# EAGLE design FRA_bulkhead_v2 (EAGLE 9.6.2)
CNAME: FRA universal bulkhead; CREVISION: 03
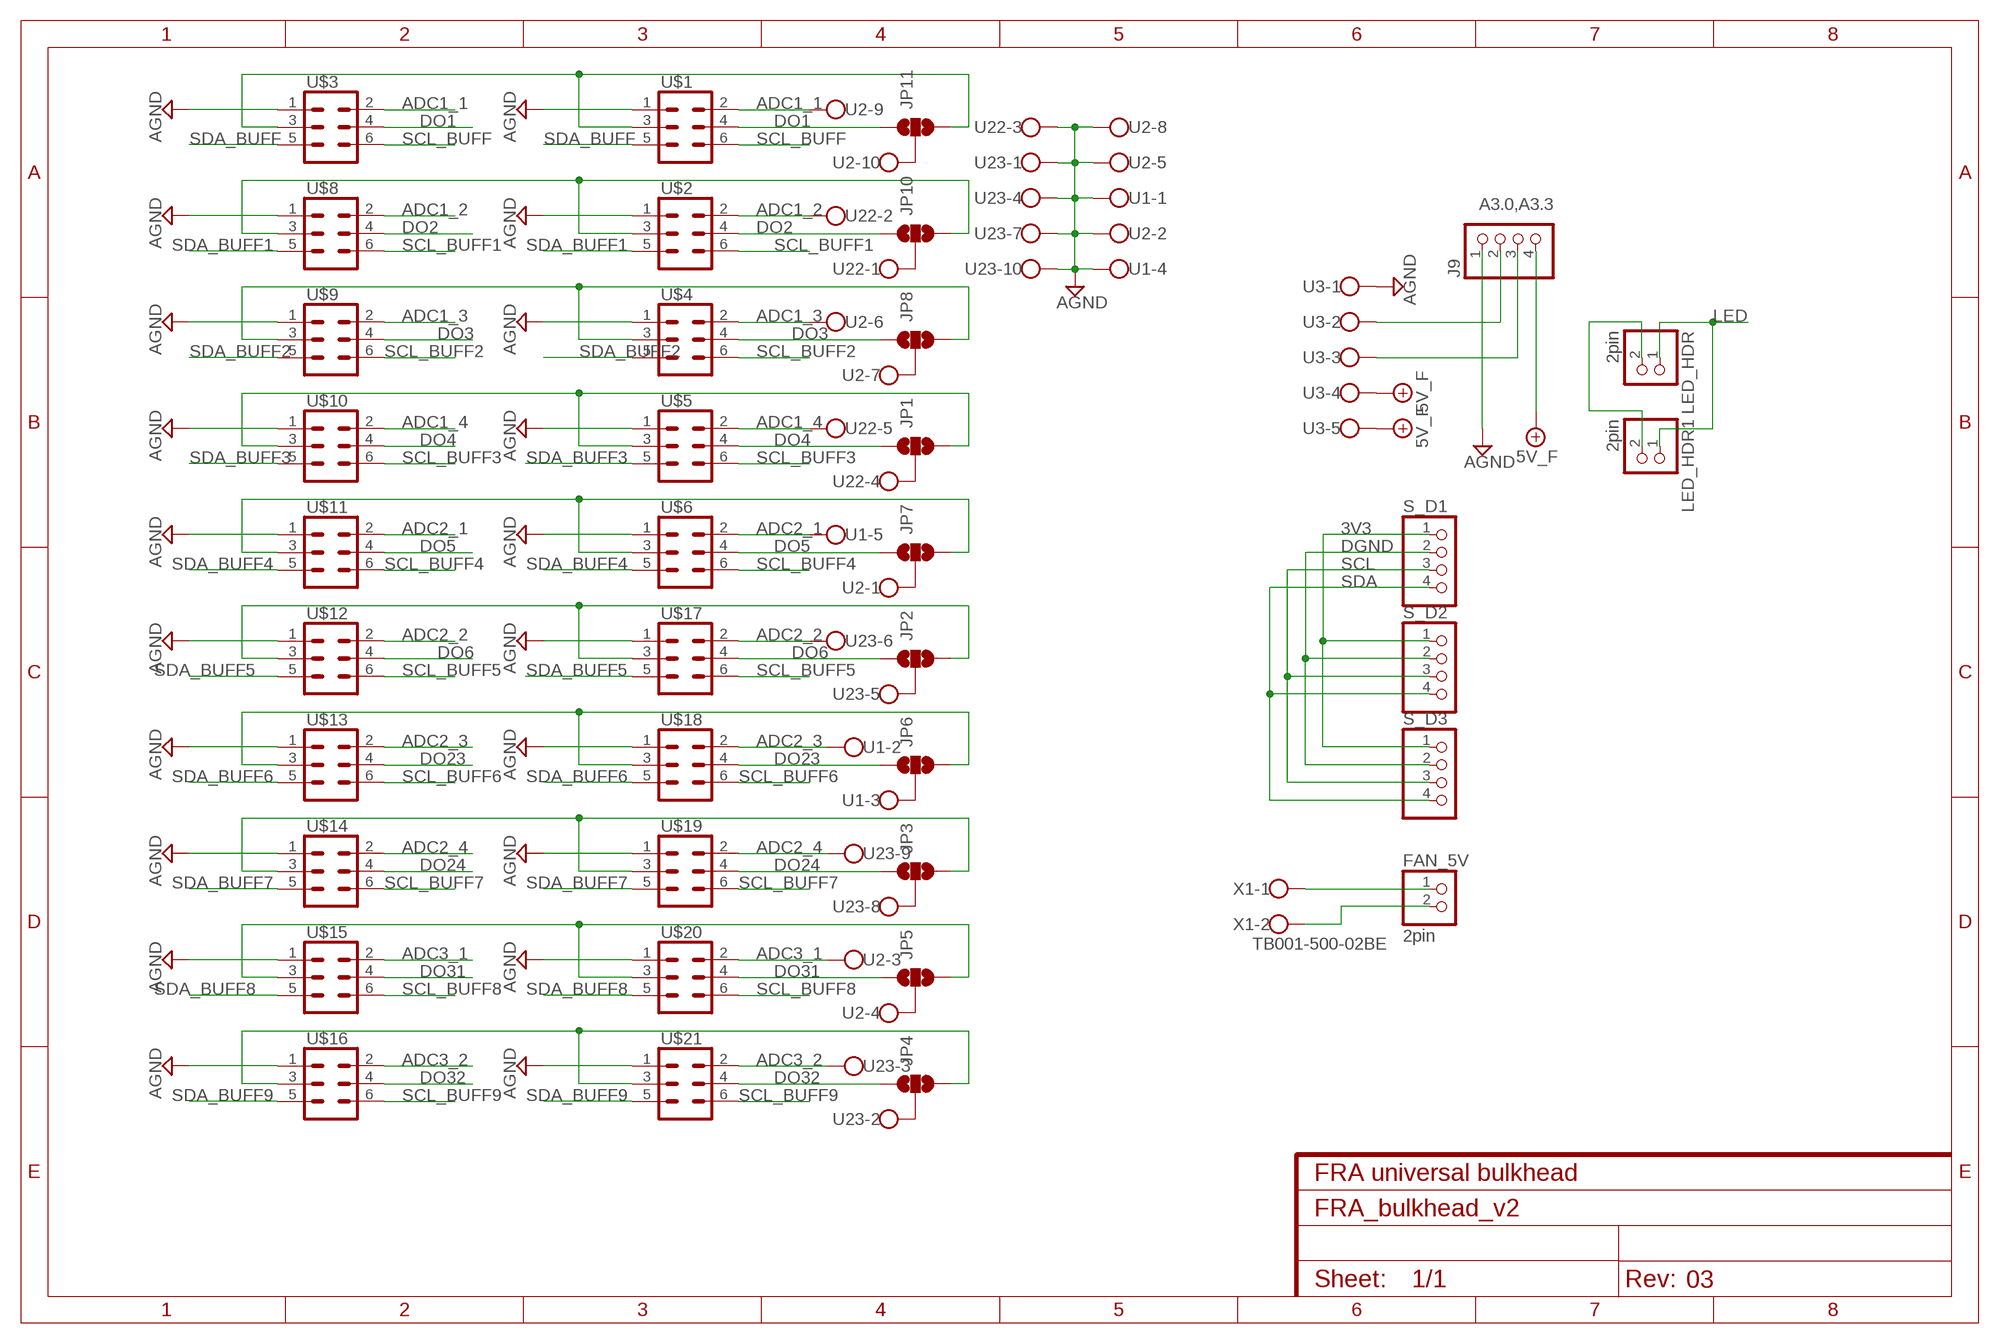
[diagram p0: schematic, sheet 1]

## Parts
FAN_5V  2pin  PINHD-1X2  [1X02]
J9  4pin  PINHD-1X4  [1X04]
JP1  JUMPER-SMT_3_NO_NO_SILK  [SMT-JUMPER_3_0-NO_TRACE_NO-SILK]
JP2  JUMPER-SMT_3_NO_NO_SILK  [SMT-JUMPER_3_0-NO_TRACE_NO-SILK]
JP3  JUMPER-SMT_3_NO_NO_SILK  [SMT-JUMPER_3_0-NO_TRACE_NO-SILK]
JP4  JUMPER-SMT_3_NO_NO_SILK  [SMT-JUMPER_3_0-NO_TRACE_NO-SILK]
JP5  JUMPER-SMT_3_NO_NO_SILK  [SMT-JUMPER_3_0-NO_TRACE_NO-SILK]
JP6  JUMPER-SMT_3_NO_NO_SILK  [SMT-JUMPER_3_0-NO_TRACE_NO-SILK]
JP7  JUMPER-SMT_3_NO_NO_SILK  [SMT-JUMPER_3_0-NO_TRACE_NO-SILK]
JP8  JUMPER-SMT_3_NO_NO_SILK  [SMT-JUMPER_3_0-NO_TRACE_NO-SILK]
JP10  JUMPER-SMT_3_NO_NO_SILK  [SMT-JUMPER_3_0-NO_TRACE_NO-SILK]
JP11  JUMPER-SMT_3_NO_NO_SILK  [SMT-JUMPER_3_0-NO_TRACE_NO-SILK]
LED_HDR  2pin  PINHD-1X2  [1X02]
LED_HDR1  2pin  PINHD-1X2  [1X02]
S_D1  4pin  PINHD-1X4  [1X04]
S_D2  4pin  PINHD-1X4  [1X04]
S_D3  4pin  PINHD-1X4  [1X04]
U1  TB003V-500-P05BERIGHTANGLE-NORMAL  [TB003-500-P05BE]
U2  TB003V-500-P10BERIGHTANGLE-NORMAL  [TB003-500-P10BE]
U3  TB003V-500-P05BERIGHTANGLE-NORMAL  [TB003-500-P05BE]
U22  TB003V-500-P05BERIGHTANGLE-NORMAL  [TB003-500-P05BE]
U23  TB003V-500-P10BERIGHTANGLE-NORMAL  [TB003-500-P10BE]
U$1  CONN_03X2_WE_61200621621  [WE_61200621621]
U$2  CONN_03X2_WE_61200621621  [WE_61200621621]
U$3  CONN_03X2_WE_61200621621  [WE_61200621621]
U$4  CONN_03X2_WE_61200621621  [WE_61200621621]
U$5  CONN_03X2_WE_61200621621  [WE_61200621621]
U$6  CONN_03X2_WE_61200621621  [WE_61200621621]
U$8  CONN_03X2_WE_61200621621  [WE_61200621621]
U$9  CONN_03X2_WE_61200621621  [WE_61200621621]
U$10  CONN_03X2_WE_61200621621  [WE_61200621621]
U$11  CONN_03X2_WE_61200621621  [WE_61200621621]
U$12  CONN_03X2_WE_61200621621  [WE_61200621621]
U$13  CONN_03X2_WE_61200621621  [WE_61200621621]
U$14  CONN_03X2_WE_61200621621  [WE_61200621621]
U$15  CONN_03X2_WE_61200621621  [WE_61200621621]
U$16  CONN_03X2_WE_61200621621  [WE_61200621621]
U$17  CONN_03X2_WE_61200621621  [WE_61200621621]
U$18  CONN_03X2_WE_61200621621  [WE_61200621621]
U$19  CONN_03X2_WE_61200621621  [WE_61200621621]
U$20  CONN_03X2_WE_61200621621  [WE_61200621621]
U$21  CONN_03X2_WE_61200621621  [WE_61200621621]
X1  TB001-500-02BE  W237-102  [W237-102]

## Nets
3V3: S_D1.1 S_D2.1 S_D3.1
+5V/1: J9.4 U3.4 U3.5 ; supply symbol labelled 5V_F
ADC1_1: U2.9 U$1.2 U$3.2
ADC1_2: U22.2 U$2.2 U$8.2
ADC1_3: U2.6 U$4.2 U$9.2
ADC1_4: U22.5 U$5.2 U$10.2
ADC2_1: U1.5 U$6.2 U$11.2
ADC2_2: U23.6 U$12.2 U$17.2
ADC2_3: U1.2 U$13.2 U$18.2
ADC2_4: U23.9 U$14.2 U$19.2
ADC3_1: U2.3 U$15.2 U$20.2
ADC3_2: U23.3 U$16.2 U$21.2
AGND: J9.1 U1.1 U1.4 U2.2 U2.5 U2.8 U3.1 U22.3 U23.1 U23.4 U23.7 U23.10 U$1.1 U$2.1 U$3.1 U$4.1 U$5.1 U$6.1 U$8.1 U$9.1 U$10.1 U$11.1 U$12.1 U$13.1 U$14.1 U$15.1 U$16.1 U$17.1 U$18.1 U$19.1 U$20.1 U$21.1
DGND: S_D1.2 S_D2.2 S_D3.2
DO1: JP11.1 U$1.4 U$3.4
DO2: JP10.1 U$2.4 U$8.4
DO3: JP8.1 U$4.4 U$9.4
DO4: JP1.1 U$5.4 U$10.4
DO5: JP7.1 U$6.4 U$11.4
DO6: JP2.1 U$12.4 U$17.4
DO23: JP6.1 U$13.4 U$18.4
DO24: JP3.1 U$14.4 U$19.4
DO31: JP5.1 U$15.4 U$20.4
DO32: JP4.1 U$16.4 U$21.4
LED: LED_HDR1.1 LED_HDR.1
N$1: FAN_5V.1 X1.1
N$2: FAN_5V.2 X1.2
N$3: JP1.2 U22.4
N$4: JP2.2 U23.5
N$5: JP3.2 U23.8
N$6: JP4.2 U23.2
N$7: JP10.2 U22.1
N$8: JP11.2 U2.10
N$9: JP8.2 U2.7
N$10: JP5.2 U2.4
N$11: JP7.2 U2.1
N$12: JP6.2 U1.3
N$13: JP11.3 U$1.3 U$3.3
N$14: J9.3 U3.3
N$15: JP10.3 U$2.3 U$8.3
N$16: J9.2 U3.2
N$17: JP8.3 U$4.3 U$9.3
N$18: JP1.3 U$5.3 U$10.3
N$19: JP7.3 U$6.3 U$11.3
N$20: JP2.3 U$12.3 U$17.3
N$21: JP6.3 U$13.3 U$18.3
N$22: JP3.3 U$14.3 U$19.3
N$23: JP5.3 U$15.3 U$20.3
N$24: JP4.3 U$16.3 U$21.3
N$26: LED_HDR1.2 LED_HDR.2
SCL: S_D1.3 S_D2.3 S_D3.3
SCL_BUFF: U$1.6 U$3.6
SCL_BUFF1: U$2.6 U$8.6
SCL_BUFF2: U$4.6 U$9.6
SCL_BUFF3: U$5.6 U$10.6
SCL_BUFF4: U$6.6 U$11.6
SCL_BUFF5: U$12.6 U$17.6
SCL_BUFF6: U$13.6 U$18.6
SCL_BUFF7: U$14.6 U$19.6
SCL_BUFF8: U$15.6 U$20.6
SCL_BUFF9: U$16.6 U$21.6
SDA: S_D1.4 S_D2.4 S_D3.4
SDA_BUFF: U$1.5 U$3.5
SDA_BUFF1: U$2.5 U$8.5
SDA_BUFF2: U$4.5 U$9.5
SDA_BUFF3: U$5.5 U$10.5
SDA_BUFF4: U$6.5 U$11.5
SDA_BUFF5: U$12.5 U$17.5
SDA_BUFF6: U$13.5 U$18.5
SDA_BUFF7: U$14.5 U$19.5
SDA_BUFF8: U$15.5 U$20.5
SDA_BUFF9: U$16.5 U$21.5

## Notes on the sheet
- A3.0,A3.3

## Library data of the parts
FAN_5V LED_HDR LED_HDR1 = pinhead:PINHD-1X2: PIN HEADER; PARTNO: TSW-102-07-G-S
J9 S_D1-S_D3 = pinhead:PINHD-1X4: PIN HEADER; PARTNO: 61300411121
JP1-JP8 JP10 JP11 = SparkFun-Jumpers:JUMPER-SMT_3_NO: Normally open jumper This jumper has three pads in close proximity to each other. Apply solder to close the connection(s).
U1 U3 U22 = SamacSys_Parts:TB003V-500-P05BE
U2 U23 = SamacSys_Parts:TB003V-500-P10BE
U$1-U$6 U$8-U$21 = FRA_eagle_lib:CONN_03X2_WE_61200621621: https://eu.mouser.com/ProductDetail/Wurth-Elektronik/61200621621?qs=sGAEpiMZZMs%252BGHln7q6pm%2FFhW%252BtWvhAgbNxkR%252BlwXp8Ip%2FAN9J9VOg%3D%3D https://eu.mouser.com/datasheet/2/445/6120xx21621-265830.pdf; PARTNO: 61200621621
X1 = con-wago-500:W237-102: WAGO SCREW CLAMP; MPN: 237-102; OC_FARNELL: unknown; OC_NEWARK: 70K9898; PARTNO: TB001-500-02BE

## Board
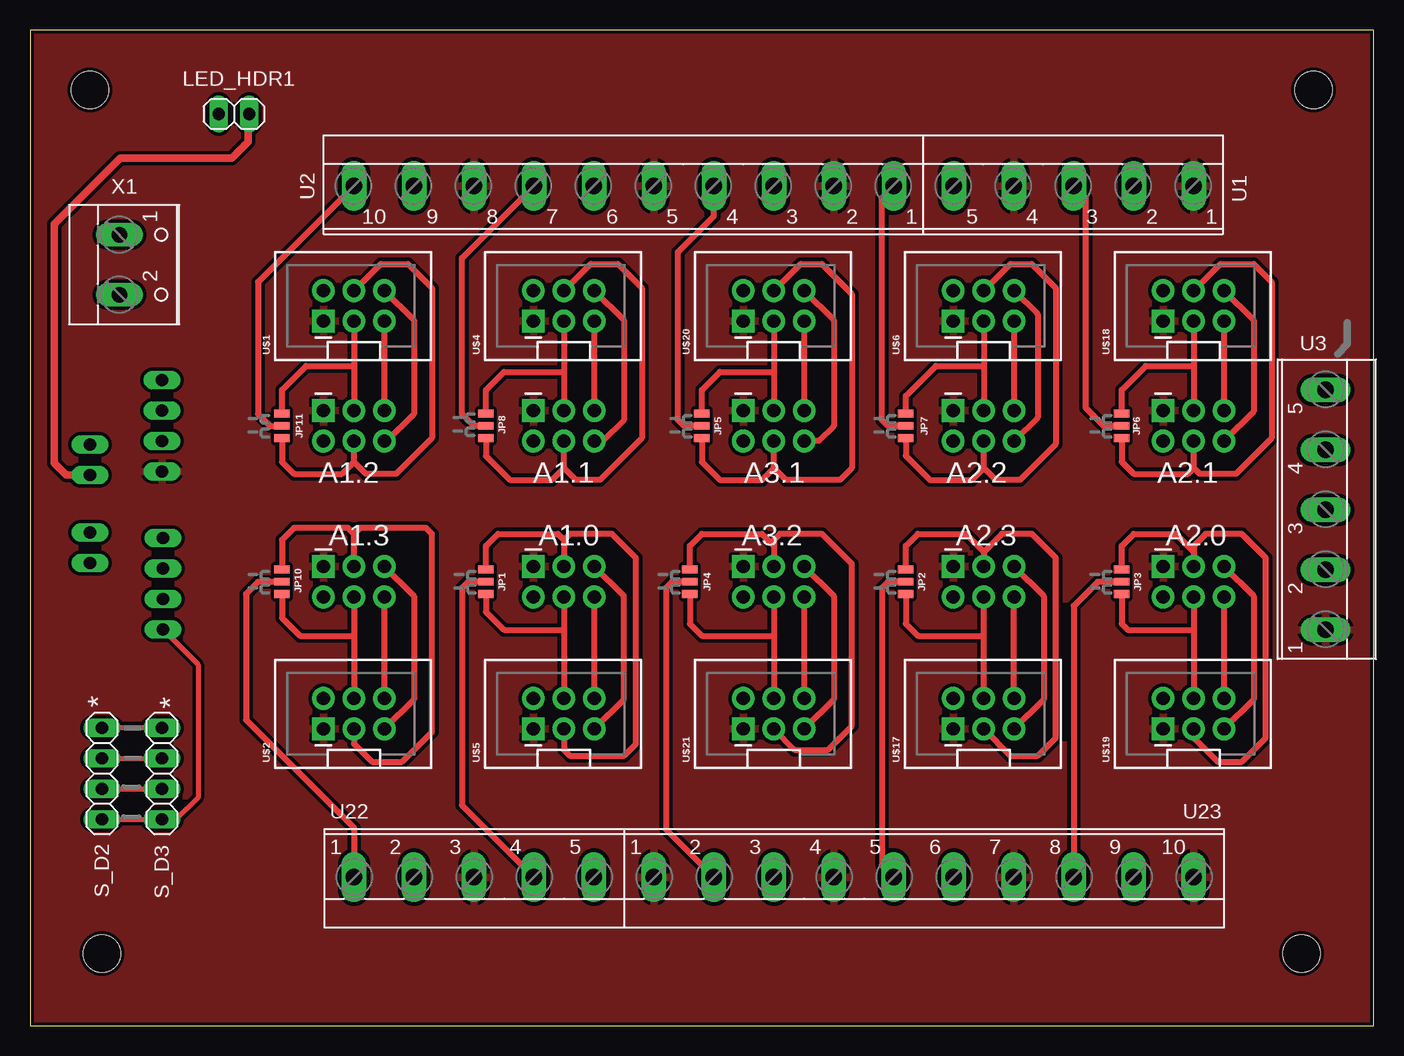
[diagram p1: board, top side]
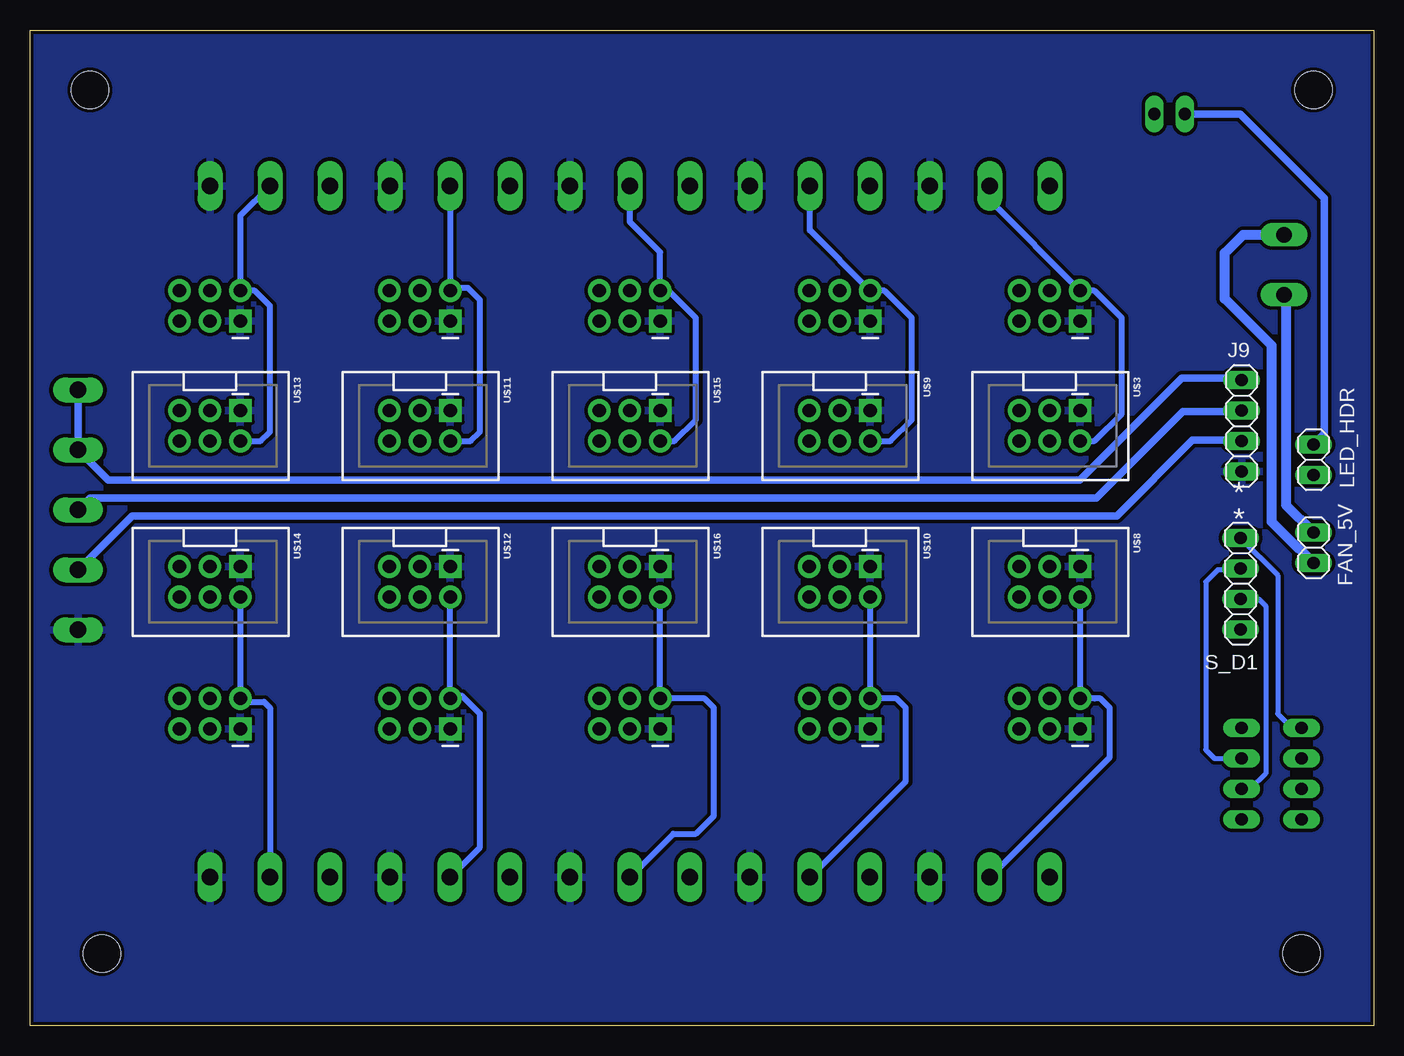
[diagram p2: board, bottom side, seen from below]

Size 112 x 83 mm. Coordinates in mm from the lower left corner, seen from the top.
Outline: 0,0 112,0 112,83 0,83 0,0
Copper layers (1*16): Top 0.035mm / dielectric 1.6mm / Bottom 0.035mm
Design rules "AllPCB": minimum track width 6mil, minimum drill 0.399mm, track to track 0.149859375mm, track to pad 0.149859375mm, pad to pad 8mil, via to via 17mil, smd to smd 6mil, copper to edge 10mil, drill to drill 24mil, minimum pad ring 10mil, minimum via ring 8mil, stop-mask expansion 4mil, vias tented up to drill 0.3mm, thermal gap 10mil
Holes 3.1 mm at 6,6 5,78 107,78 106,6
tKeepout: area 3.5,3.5 to 8.5,8.5; area 103.5,3.5 to 108.5,8.5; area 104.5,75.5 to 109.5,80.5; area 2.5,75.5 to 7.5,80.5

### Footprints (pad centres in the part's own frame; a part is rotated, then mirrored left to right if it is on the bottom)
1X02 = drill 1.016 long: 1 -1.27,0; 2 1.27,0
1X04 = drill 1.016 long: 1 -3.81,0; 2 -1.27,0; 3 1.27,0; 4 3.81,0
SMT-JUMPER_3_0-NO_TRACE_NO-SILK = smd 0.635 x 1.27: 1 -1.016,0; 2 0,0; 3 1.016,0
TB003-500-P05BE = drill 1.4 long: 1 0,0; 3 10,0; 4 15,0; 5 20,0 | drill 1.4 pad 1.93 long: 2 5,0
TB003-500-P10BE = drill 1.4 long: 1 0,0; 3 10,0; 4 15,0; 5 20,0; 6 25,0; 7 30,0; 8 35,0; 9 40,0; 10 45,0 | drill 1.4 pad 1.93 long: 2 5,0
WE_61200621621 = drill 1.1 pad 1.88 square: 1 -1.27,2.54 | drill 1.1 pad 1.88: 2 1.27,2.54; 3 -1.27,0; 4 1.27,0; 5 -1.27,-2.54; 6 1.27,-2.54
W237-102 = drill 1.3 long: 1 -2.5,-1.27; 2 2.5,-1.27

### Placement (x,y rotation side)
FAN_5V  5,39.84 90 bottom
J9  11,50 90 bottom
JP1  38,37 90 top
JP2  73,37 90 top
JP3  91,37 90 top
JP4  55,37 90 top
JP5  56,50 90 top
JP6  91,50 90 top
JP7  73,50 90 top
JP8  38,50 90 top
JP10  21,37 90 top
JP11  21,50 90 top
LED_HDR  5,47.17 270 bottom
LED_HDR1  17,76 0 top
S_D1  11.09,36.83 270 bottom
S_D2  6,21 270 top
S_D3  11,21 270 top
U1  97,70 180 top
U2  72,70 180 top
U3  108,33 90 top
U22  27,12.37 0 top
U23  52,12.37 0 top
U$1  27,60 90 top
U$2  27,26 90 top
U$3  27,50 270 bottom
U$4  44.5,60 90 top
U$5  44.5,26 90 top
U$6  79.5,60 90 top
U$8  27,37 270 bottom
U$9  44.5,50 270 bottom
U$10  44.5,37 270 bottom
U$11  79.5,50 270 bottom
U$12  79.5,37 270 bottom
U$13  97,50 270 bottom
U$14  97,37 270 bottom
U$15  62,50 270 bottom
U$16  62,37 270 bottom
U$17  79.5,26 90 top
U$18  97,60 90 top
U$19  97,26 90 top
U$20  62,60 90 top
U$21  62,26 90 top
X1  8.71,63.43 270 top

### Tracks (layer width: path | path; a pad name or v marks a point on that pad's centre or on a via)
3V3
  Top 0.406: S_D3.1 S_D2.1
  Bottom 0.406: S_D1.1 8,37.55 8,26 6.81,24.81 S_D2.1
+5V/1
  Bottom 0.61: U3.5 U3.4 105.5,45.5 24.5,45.5 16,54 11.19,54 J9.4
ADC1_1
  Bottom 0.508: U$3.2 23.27,48.73 21,51 21,59 23.27,61.27 U$1.2 32,68.81 U2.9
ADC1_2
  Bottom 0.508: 23.23,27.27 U$2.2 | U22.2 22,22.37 22,26.5 22.77,27.27 U$2.2 | U$8.2 U$2.2
ADC1_3
  Bottom 0.508: U$9.2 40.27,48.73 38.5,50.5 38.5,59 40.77,61.27 U$4.2 47,66.31 U2.6
ADC1_4
  Bottom 0.508: U$10.2 U$5.2 39.77,27.27 39,26.5 39,20.37 U22.5
ADC2_1
  Bottom 0.508: U$11.2 75.27,48.73 74.5,49.5 74.5,60.5 75.5,61.5 76.73,61.5 U$6.2 77,61.31 U1.5
ADC2_2
  Bottom 0.508: U$17.2 76.96,27.5 | 76.96,27.5 U$12.2 | U23.6 74.5,14.87 74.5,26 76,27.5 76.96,27.5
ADC2_3
  Bottom 0.508: U$13.2 92.77,48.73 92,49.5 92,60 93.27,61.27 U$18.2 94.46,67.54 U1.2
ADC2_4
  Bottom 0.508: U$14.2 U$19.2 94.19,27 92.5,27 92,26.5 U23.9
ADC3_1
  Bottom 0.508: U$15.2 58.27,48.73 56.5,50.5 56.5,59 58.77,61.27 U$20.2 59.46,64.46 62,67 U2.3
ADC3_2
  Bottom 0.508: U$16.2 U$21.2 55.77,27.27 55,26.5 55,17.5 56.5,16 58.37,16 U23.3
AGND
  pour Bottom (isolate 0.3): -7.5,92 122.5,92 122.5,-16 -7.5,-16
  pour Top (isolate 0.3): -12.5,97 128.5,97 128.5,-21 -12.5,-21
DGND
  Top 0.406: S_D2.2 S_D3.2 11.23,22.5
  Bottom 0.406: S_D1.2 11.18,38 13,38 14,37 14,23 13.27,22.27 S_D3.2
DO1
  Top 0.508: JP11.1 21,47 22,46 26,46 27,47 | 27,47 U$3.4 | U$1.4 29.23,63.5 31.5,63.5 33.5,61.5 33.5,49 30.5,46 28,46 27,47
DO2
  Top 0.508: U$8.4 27,32.5 | 27,32.5 U$2.4 | JP10.1 21,34 22.5,32.5 27,32.5
DO3
  Top 0.508: JP8.1 38,47.5 40,45.5 43.5,45.5 44.5,46.5 | 44.5,46.5 U$9.4 | U$4.4 46.73,63.5 49,63.5 51,61.5 51,49 47.5,45.5 45.5,45.5 44.5,46.5
DO4
  Top 0.508: U$10.4 44.5,33 | 44.5,33 U$5.4 | JP1.1 38,34.5 39.5,33 44.5,33
DO5
  Top 0.508: JP7.1 73,47.5 75,45.5 78.5,45.5 79.5,46.5 | 79.5,46.5 U$11.4 | U$6.4 81.73,63.5 83.5,63.5 85.5,61.5 85.5,48.5 82.5,45.5 80.5,45.5 79.5,46.5
DO6
  Top 0.508: JP2.1 73,33.5 74,32.5 79.5,32.5 | 79.5,32.5 U$12.4 | U$17.4 79.5,32.5
DO23
  Top 0.508: U$18.4 99.23,63.5 102,63.5 103.5,62 103.5,49 100.5,46 97.5,46 97,46.5 | 97,46.5 U$13.4 | JP6.1 91,47 92,46 96.5,46 97,46.5
DO24
  Top 0.508: U$14.4 97,33 | 97,33 U$19.4 | JP3.1 91,33.5 91.5,33 97,33
DO31
  Top 0.508: JP5.1 56,47 57.5,45.5 61,45.5 62,46.5 | 62,46.5 U$15.4 | U$20.4 64.23,63.5 66,63.5 68.5,61 68.5,46.5 67.5,45.5 63,45.5 62,46.5
DO32
  Top 0.508: U$16.4 62,32.5 | 62,32.5 U$21.4 | JP4.1 55,33.5 56,32.5 62,32.5
LED
  Bottom 0.61: LED_HDR.1 4.1,49.33 4.1,69 11.1,76 LED_HDR1.1
N$1
  Bottom 0.813: FAN_5V.1 6.22,39.79 6.31,39.79 8.5,41.98 8.5,56.7 12.4,60.6 12.4,64.4 10.87,65.93 X1.1
N$2
  Bottom 0.813: FAN_5V.2 7.3,43.41 7.3,60.79 X1.2
N$3
  Top 0.508: JP1.2 36.5,37 36,36.5 36,18.37 U22.4
N$4
  Top 0.508: JP2.2 71.5,37 71,36.5 71,13.37 U23.5
N$5
  Top 0.508: U23.8 87,35 89,37 JP3.2
N$6
  Top 0.508: JP4.2 53.5,37 53,36.5 53,16.37 U23.2
N$7
  Top 0.508: JP10.2 19,37 18,36 18,25.5 27,16.5 U22.1
N$8
  Top 0.508: U2.10 19,62 19,51 20,50 JP11.2
N$9
  Top 0.508: JP8.2 37,50 36,51 36,64 U2.7
N$10
  Top 0.508: JP5.2 54.5,50 54,50.5 54,64.5 57,67.5 U2.4
N$11
  Top 0.508: JP7.2 71.5,50 71,50.5 71,69 U2.1
N$12
  Top 0.508: JP6.2 89.5,50 88,51.5 88,69 U1.3
N$13
  Top 0.508: U$1.3 27,55 | 27,55 U$3.3 | JP11.3 21,53 23,55 27,55
N$14
  Bottom 0.61: U3.3 107,44 23.1,44 15.9,51.2 11.07,51.2 J9.3
N$15
  Top 0.508: U$8.3 27,41 | 27,41 26.5,41.5 22,41.5 21,40.5 JP10.3 | U$2.3 27,23.5 28.5,22 31,22 33.5,24.5 33.5,41 33,41.5 27.5,41.5 27,41
N$16
  Bottom 0.61: U3.2 103.5,42.5 21.4,42.5 15.1,48.8 11.07,48.8 J9.2
N$17
  Top 0.508: U$4.3 44.5,54.5 | 44.5,54.5 U$9.3 | JP8.3 38,53 39.5,54.5 44.5,54.5
N$18
  Top 0.508: JP1.3 38,40 39,41 44,41 44.5,40.5 | 44.5,40.5 U$10.3 | U$5.3 44.5,23 45,22.5 49.5,22.5 50.5,23.5 50.5,39 48.5,41 45,41 44.5,40.5
N$19
  Top 0.508: U$6.3 79.5,55 | 79.5,55 U$11.3 | JP7.3 73,52.5 75.5,55 79.5,55
N$20
  Top 0.508: JP2.3 73,40 74,41 78,41 79.5,39.5 | 79.5,39.5 U$12.3 | U$17.3 81.73,22.5 84,22.5 85.5,24 85.5,39 83.5,41 81,41 79.5,39.5
N$21
  Top 0.508: U$18.3 97,55 | 97,55 U$13.3 | JP6.3 91,53 93,55 97,55
N$22
  Top 0.508: JP3.3 91,40 92,41 95.5,41 97,39.5 | 97,39.5 U$14.3 | U$19.3 97,24 99,22 101,22 103,24 103,39 101,41 98,41 97,40 97,39.5
N$23
  Top 0.508: U$20.3 62,54.5 | 62,54.5 U$15.3 | JP5.3 56,53 57.5,54.5 62,54.5
N$24
  Top 0.508: JP4.3 55,40 56,41 61,41 62,40 | 62,40 U$16.3 | U$21.3 63.73,23 66.5,23 68.5,25 68.5,38.5 66,41 62.5,41 62,40.5 62,40
N$26
  Top 0.61: LED_HDR1.2 18.2,75.93 18.2,73.7 16.8,72.3 7.5,72.3 2,66.8 2,46.9 3,45.89 LED_HDR.2
SCL
  Top 0.406: S_D2.3 S_D3.3 12.27,19.73
  Bottom 0.406: S_D1.3 9.56,35.56 9,35 9,21 10.27,19.73 S_D3.3
SCL_BUFF
  Top 0.508: U$1.6 32,58.81 32,51 29.73,48.73 U$3.6
SCL_BUFF1
  Top 0.508: U$8.6 U$2.6
SCL_BUFF2
  Top 0.508: U$4.6 49.5,58.81 49.5,50.5 47.73,48.73 U$9.6
SCL_BUFF3
  Top 0.508: U$10.6 U$5.6
SCL_BUFF4
  Top 0.508: U$6.6 84,59.31 84,50.69 U$11.6
SCL_BUFF5
  Top 0.508: U$17.6 U$12.6
SCL_BUFF6
  Top 0.508: U$18.6 102,58.81 102,51.19 U$13.6
SCL_BUFF7
  Top 0.508: U$14.6 U$19.6
SCL_BUFF8
  Top 0.508: U$20.6 67,58.81 67,50 65.73,48.73 U$15.6
SCL_BUFF9
  Top 0.508: U$16.6 U$21.6
SDA
  Top 0.406: S_D2.4 S_D3.4 12.19,17.19 14,19 14,30.1 S_D1.4
SDA_BUFF
  Top 0.508: U$1.5 U$3.5
SDA_BUFF1
  Top 0.508: U$8.5 32,35.81 32,27.19 U$2.5
SDA_BUFF2
  Top 0.508: U$4.5 U$9.5
SDA_BUFF3
  Top 0.508: U$10.5 49.5,35.81 49.5,27.19 U$5.5
SDA_BUFF4
  Top 0.508: U$6.5 U$11.5
SDA_BUFF5
  Top 0.508: U$12.5 84.5,35.81 84.5,27.19 U$17.5
SDA_BUFF6
  Top 0.508: U$18.5 U$13.5
SDA_BUFF7
  Top 0.508: U$14.5 102,35.81 102,27.19 U$19.5
SDA_BUFF8
  Top 0.508: U$20.5 U$15.5
SDA_BUFF9
  Top 0.508: U$16.5 67,35.81 67,27.19 U$21.5

### Text on the board
tNames: A1.2 | A1.1 | A3.1 | A2.2 | A2.1 | A1.3 | A1.0 | A3.2 | A2.3 | A2.0 | * | *
bNames: * | *
tDocu: FRA universal bulkhead v2 | +5V A1.2 GND +5V A1.1 GND +5V A3.1 GND +5V A2.2 GND +5V A2.1 GND | LED- | LED+ | +5V/2A / Power | GND +5V | (FAN) | Power selection / +5V 100mA low noise / +5V 2A power / sum current for all outputs | GND A3.3 A3.0 +5V +5V | 100mA / / 2A | 100mA / / 2A | 100mA / / 2A | 100mA / / 2A | 100mA / / 2A | solder bridge / only one option | 100mA / / 2A | 100mA / / 2A | 100mA / / 2A | 100mA / / 2A | 100mA / / 2A | 3V3 | GND | SCL | SDA | +5V A1.3 GND +5V A1.0 GND +5V A3.2 GND +5V A2.3 GND +5V A2.0 GND | Electronics design solutions s.r.o. | J.Repcik / 12/2020
bDocu: 5V | LED+ | A3.0 | A3.3 | LED- | AGND | GND | 5V | SDA_5V | - | +5V | 3V3 | GND | SCL | SDA | ADC | SCL_5V | 5V / HiZ